# EAGLE design DCDC-12V5V1A (EAGLE 9.6.2)
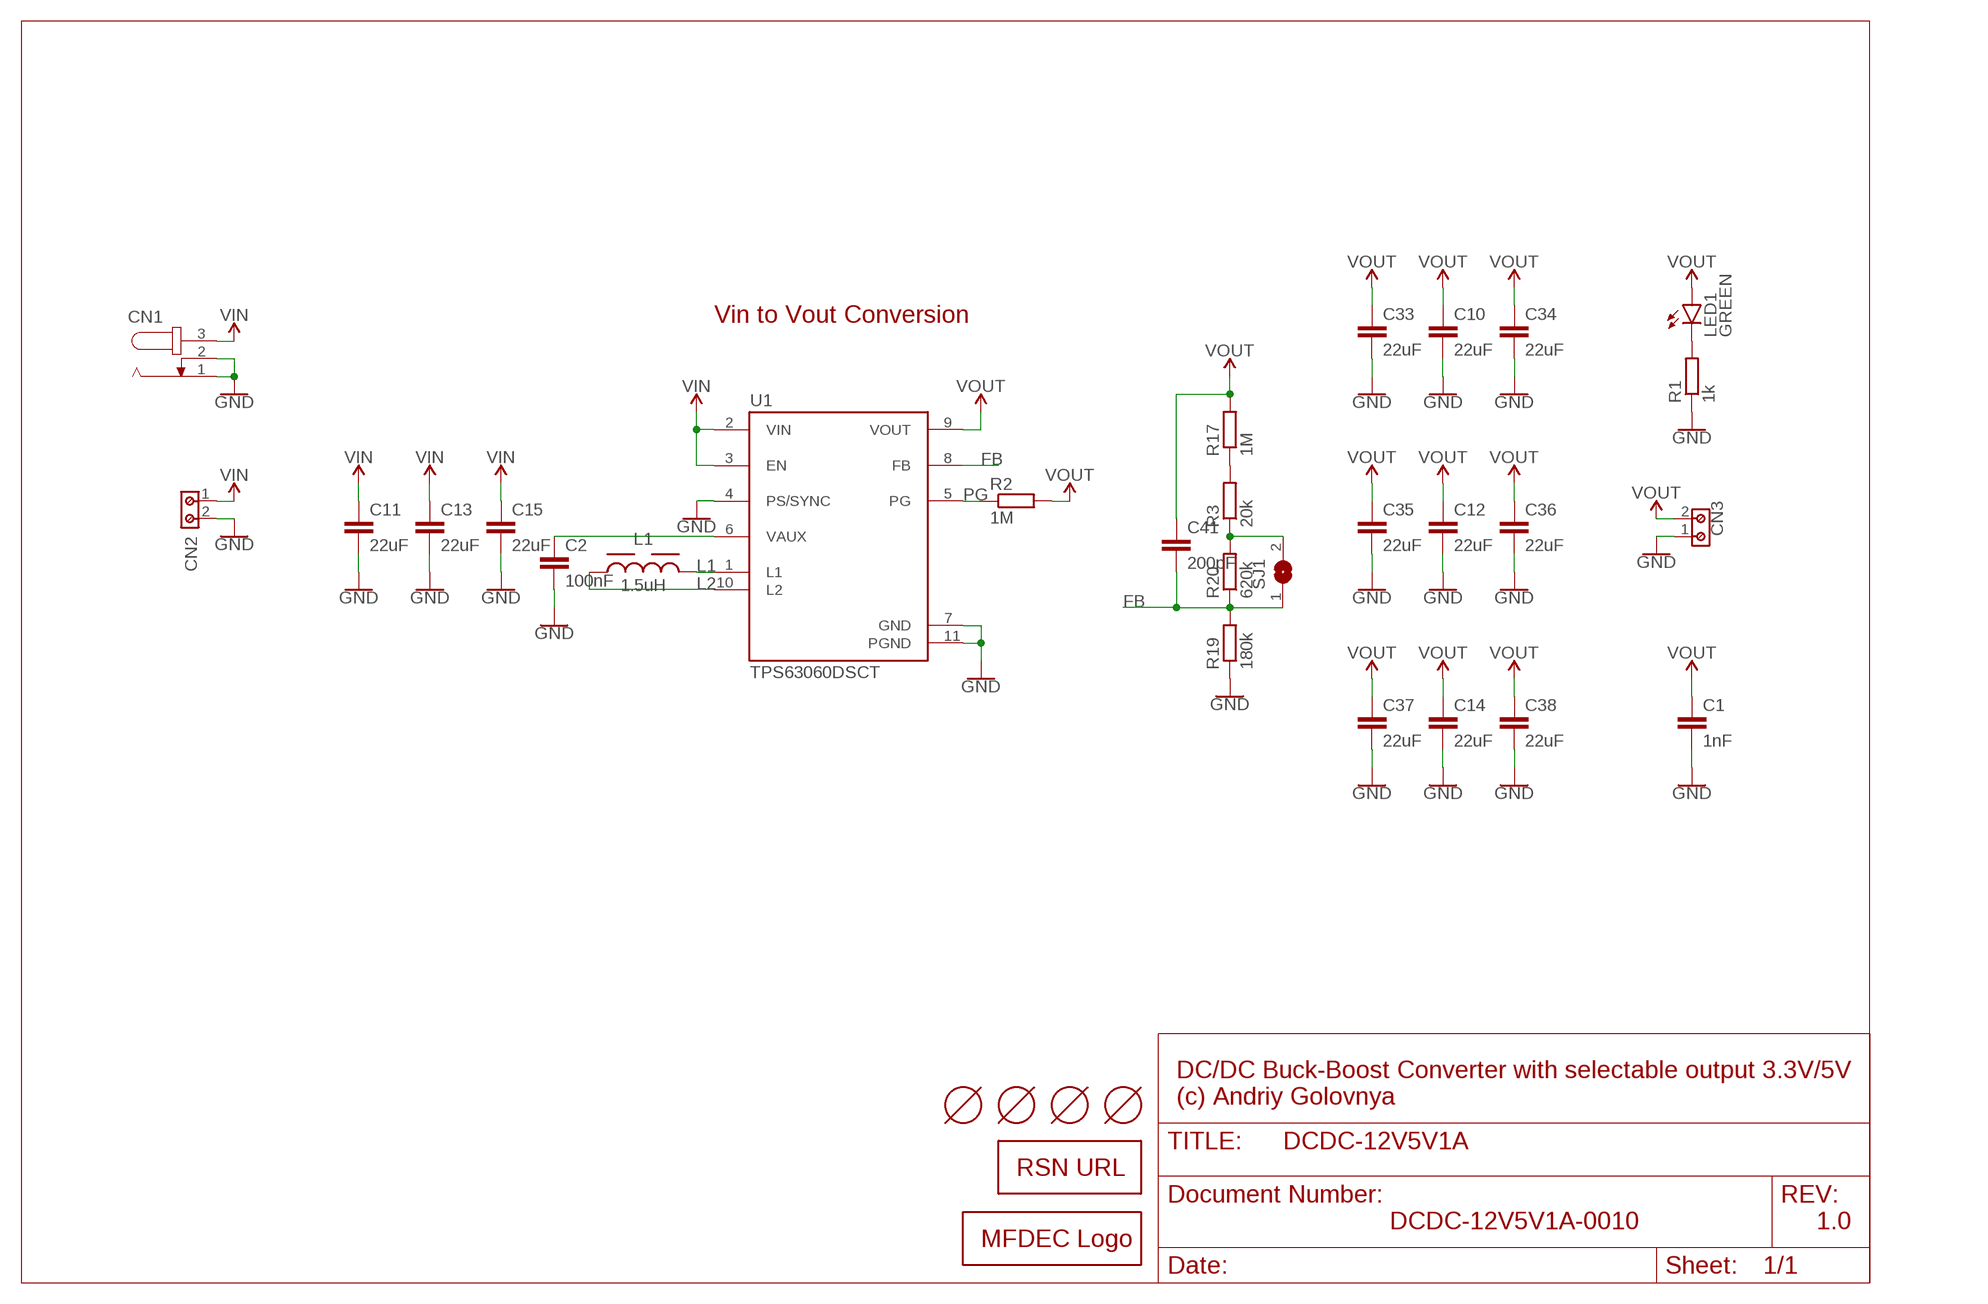
[diagram p0: schematic, sheet 1]

## Parts
C1  1nF  C-EUC0603K  [C0603K]
C2  100nF  C-EUC0603K  [C0603K]
C10  22uF  C-EUC0805K  [C0805K]
C11  22uF  C-EUC0805K  [C0805K]
C12  22uF  C-EUC0805K  [C0805K]
C13  22uF  C-EUC0805K  [C0805K]
C14  22uF  C-EUC0805K  [C0805K]
C15  22uF  C-EUC0805K  [C0805K]
C33  22uF  C-EUC0805K  [C0805K]
C34  22uF  C-EUC0805K  [C0805K]
C35  22uF  C-EUC0805K  [C0805K]
C36  22uF  C-EUC0805K  [C0805K]
C37  22uF  C-EUC0805K  [C0805K]
C38  22uF  C-EUC0805K  [C0805K]
C41  200pF  C-EUC0603K  [C0603K]
CN1  JACK-PLUG1  [SPC4078]
CN2  691213510002  [691213510002]
CN3  691213510002  [691213510002]
HOLE1  TOOLINGHOLE  [TOOLING-HOLE]
HOLE2  TOOLINGHOLE  [TOOLING-HOLE]
HOLE3  TOOLINGHOLE  [TOOLING-HOLE]
HOLE4  TOOLINGHOLE  [TOOLING-HOLE]
L1  1.5uH  WE-LQS_4018_74404042010  [WE-LQS_4018]
LED1  GREEN  LEDSML0603  [SML0603]
LOGO1  RSNURL_QR_8MM  [RSNURL_QR_8MM]
LOGO2  MFDECLOGO_L_10MM  [MFDEC_L_10MM]
R1  1k  R-EU_R0603  [R0603]
R2  1M  R-EU_R0603  [R0603]
R3  20k  R-EU_R0603  [R0603]
R17  1M  R-EU_R0603  [R0603]
R19  180k  R-EU_R0603  [R0603]
R20  620k  R-EU_R0603  [R0603]
SJ1  SJ  [SJ]
U1  TPS63060DSCT  [CONV_TPS63060DSCT]

## Nets
FB: C41.2 R19.2 R20.1 SJ1.1 U1.8(FB)
GND: C1.2 C2.2 C10.2 C11.2 C12.2 C13.2 C14.2 C15.2 C33.2 C34.2 C35.2 C36.2 C37.2 C38.2 CN1.1 CN1.2 CN2.2 CN3.1 R1.1 R19.1 U1.4(PS/SYNC) U1.7(GND) U1.11(PGND)
L1: L1.2 U1.1(L1)
L2: L1.1 U1.10(L2)
N$1: LED1.C R1.2
N$2: R3.2 R17.1
N$3: R3.1 R20.2 SJ1.2
PG: R2.1 U1.5(PG)
VIN: C11.1 C13.1 C15.1 CN1.3 CN2.1 U1.2(VIN) U1.3(EN)
VINA: C2.1 U1.6(VAUX)
VOUT: C1.1 C10.1 C12.1 C14.1 C33.1 C34.1 C35.1 C36.1 C37.1 C38.1 C41.1 CN3.2 LED1.A R2.2 R17.2 U1.9(VOUT)

## Notes on the sheet
- Vin to Vout Conversion
- DC/DC Buck-Boost Converter with selectable output 3.3V/5V
  (c) Andriy Golovnya
- DCDC-12V5V1A-0010 | 1.0

## Library data of the parts
C1 C2 C10-C15 C33-C38 C41 = rcl:C-EU: CAPACITOR, European symbol; SPICEPREFIX: C
CN1 = con-jack:JACK-PLUG: DC POWER JACK Power Jack, DC, Right Angle, Through Hole, Rated 5A at 16VDC, PC Terminals Distributor: Farnell (www.Farnell.de) Drawing: 84N1161.pdf / 84N1162.pdf Manufacturer: SPC Technology (www.spctechnology.com) Type: SPC4077 / SPC 4078; OC_FARNELL: unknown; OC_NEWARK: unknown
CN2 CN3 = Wurth_Connectors_WR-TBL Rising Cage Clamp:691213510002: WR-TBL Serie 2135 - 5.08 mm Horizontal Entry Modular w. Rising Cage Clamp KIND PROPERTIES Pitch 5.08 mm MATERIAL PROPERTIES Insulator Material PA66 Insulator Flammability Rating UL94 V-0 Contact Material Copper Alloy Contact Plating Tin over Nickel Contact Type Stamped Terminal Screw Material Steel Terminal Screw Plating Zinc Wire Guard Material Copper Alloy GENERAL INFORMATION Operating Temperature -30 up to +120 °C Compliance ROHS & Reach ELECTRICAL PROPERTIES IR UL 14 A IR VDE 14 A Working Voltage [UL] 300 V (AC) Working Voltage [VDE] 250 V (AC) Withstanding Voltage [UL] 1600 V (AC) Withstanding Voltage [VDE] 2000 V (AC) Contact Resistance 20 mΩ MECHANICAL PROPERTIES Wire Strip Length 6 Screw M3 CERTIFICATION UL Approval E150931 VDE Approval 40021366 PACKAGING PROPERTIES Packaging Box <https://www.we-online.com/catalog/media/o32805v209%20Family_WR-TBL2_Series2135.jpg> Details see: https://www.we-online.com/catalog/en/TBL_5_08_2135_HORIZONTAL_ENTRY_MODULAR_69121351000x/ Updated by Ella Wu 2019-11-26 2019(C) Wurth Elektronik; IR-UL: 14A; IR-VDE: 14A; PART-NUMBER: 691213510002; PINS: 2; PITCH: 5.08mm; TYPE: Horizontal; WIRE: 14 to 30 (AWG) 2.08 to 0.0509 (mm²); WORKING-VOLTAGE-UL: 300V (AC); WORKING-VOLTAGE-VDE: 250V (AC)
HOLE1-HOLE4 = _my_fiducia:TOOLINGHOLE: JLCPCB Tooling Hole
L1 = Wurth_Power Magnetics_WE-LQS:WE-LQS_4018: WE-LQS SMD Power Inductor Semi Shielded Characteristics Compact design Power Inductor 1.7 times more current than compared to an unshielded version Robust construction Low RDC Magnetically shielded by use of a magnetic resin Operating temperature: -40°C to +125°C Applications Integrated DC/DC Converters Switching controllers which require high efficiency Portable power (PDA, Smartphones, Digital Cameras, TVs, LCD etc.) Embedded Laptops and PCs Big sizes can be used in shock resisting circuits <https://www.we-online.com/catalog/media/o14807v209%20Family_WE-LQS.jpg> Details see: www.we-online.com/catalog/WE-LQS <www.we-online.com/catalog/WE-LQS/?utm_source=eagle_model&utm_medium=description_link&utm_campaign=eisos_eagle> Updated by Ella Wu 2022-07-21 2022 (C) Wurth Elektronik; DATASHEET-URL: https://www.we-online.com/redexpert/spec/74404042010?ae; FRES: 120MHz; IR: 3.2A; ISAT: 4.8A; PART-NUMBER: 74404042010; RDC: 27mOhm; VALUE: 1uH
LED1 = led:LED: LED OSRAM: - CHIPLED LG R971, LG N971, LY N971, LG Q971, LY Q971, LO R971, LY R971 LH N974, LH R974 LS Q976, LO Q976, LY Q976 LO Q996 - Hyper CHIPLED LW Q18S LB Q993, LB Q99A, LB R99A - SideLED LS A670, LO A670, LY A670, LG A670, LP A670 LB A673, LV A673, LT A673, LW A673 LH A674 LY A675 LS A676, LA A676, LO A676, LY A676, LW A676 LS A679, LY A679, LG A679 - Hyper Micro SIDELED® LS Y876, LA Y876, LO Y876, LY Y876 LT Y87S - SmartLED LW L88C, LW L88S LB L89C, LB L89S, LG L890 LS L89K, LO L89K, LY L89K LS L896, LA L896, LO L896, LY L896 - TOPLED LS T670, LO T670, LY T670, LG T670, LP T670 LSG T670, LSP T670, LSY T670, LOP T670, LYG T670 LG T671, LOG T671, LSG T671 LB T673, LV T673, LT T673, LW T673 LH T674 LS T676, LA T676, LO T676, LY T676, LB T676, LH T676, LSB T676, LW T676 LB T67C, LV T67C, LT T67C, LS T67K, LO T67K, LY T67K, LW E67C LS E67B, LA E67B, LO E67B, LY E67B, LB E67C, LV E67C, LT E67C LW T67C LS T679, LY T679, LG T679 LS T770, LO T770, LY T770, LG T770, LP T770 LB T773, LV T773, LT T773, LW T773 LH T774 LS E675, LA E675, LY E675, LS T675 LS T776, LA T776, LO T776, LY T776, LB T776 LHGB T686 LT T68C, LB T68C - Hyper Mini TOPLED® LB M676 - Mini TOPLED Santana® LG M470 LS M47K, LO M47K, LY M47K Source: http://www.osram.convergy.de LUXEON: - LUMILED® LXK2-PW12-R00, LXK2-PW12-S00, LXK2-PW14-U00, LXK2-PW14-V00 LXK2-PM12-R00, LXK2-PM12-S00, LXK2-PM14-U00 LXK2-PE12-Q00, LXK2-PE12-R00, LXK2-PE12-S00, LXK2-PE14-T00, LXK2-PE14-U00 LXK2-PB12-K00, LXK2-PB12-L00, LXK2-PB12-M00, LXK2-PB14-N00, LXK2-PB14-P00, LXK2-PB14-Q00 LXK2-PR12-L00, LXK2-PR12-M00, LXK2-PR14-Q00, LXK2-PR14-R00 LXK2-PD12-Q00, LXK2-PD12-R00, LXK2-PD12-S00 LXK2-PH12-R00, LXK2-PH12-S00 LXK2-PL12-P00, LXK2-PL12-Q00, LXK2-PL12-R00 Source: www.luxeon.com KINGBRIGHT: KA-3528ASYC Source: www.kingbright.com
LOGO1 = _my_logos:RSNURL: RedScorp.Net URL
LOGO2 = _my_logos:MFDECLOGO: Midnight Fog - Digital Eye Candy LOGO
R1-R3 R17 R19 R20 = rcl:R-EU_: RESISTOR, European symbol; SPICEPREFIX: R
SJ1 = _my_jumpers:SJ: SMD solder JUMPER SJ - simple jumper SJFL - fancy left jumper SJFR - fancy right jumper SJW - wide jumper
U1 = TPS63060DSCT:TPS63060DSCT: Check availability <https://pricing.snapeda.com/parts/TPS63060DSCT/Texas%20Instruments/view-part?ref=eda>; AVAILABILITY: In Stock; DESCRIPTION: 2.5V to 12V input voltage, 93% Efficient, 2.25A Switch Current Limit, Buck-Boost Converter; MF: Texas Instruments; MP: TPS63060DSCT; PACKAGE: WSON-10 Texas Instruments; PRICE: None; PURCHASE-URL: https://pricing.snapeda.com/search?q=TPS63060DSCT&ref=eda

## Net classes
0 default: width 0.254 mm

## Board
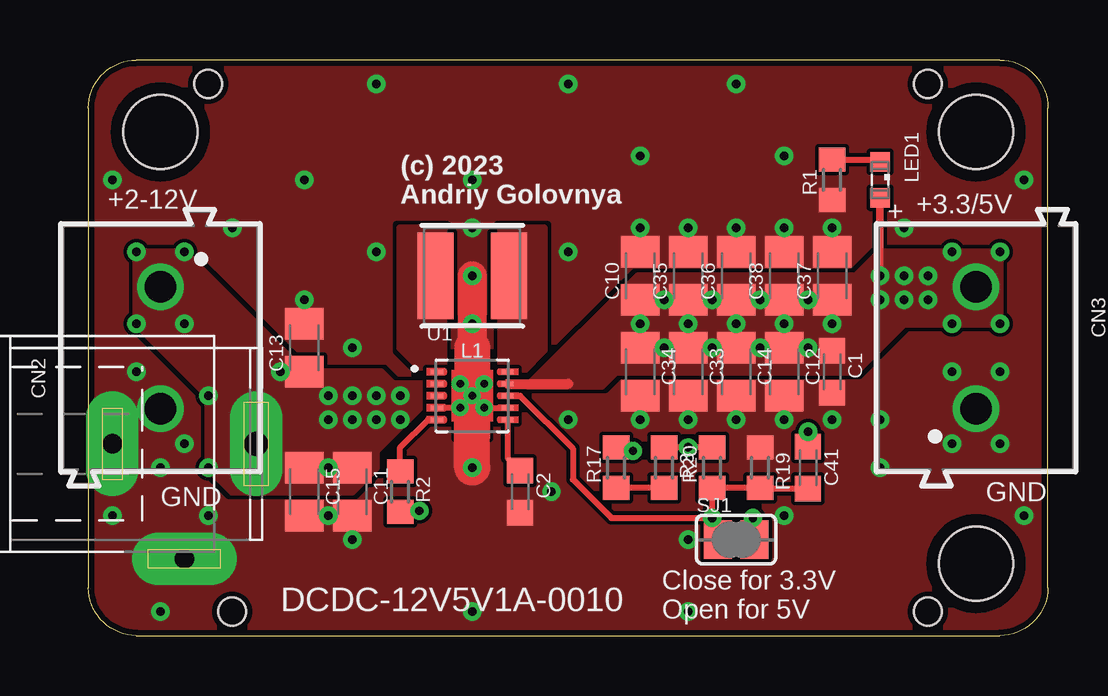
[diagram p1: board, top side]
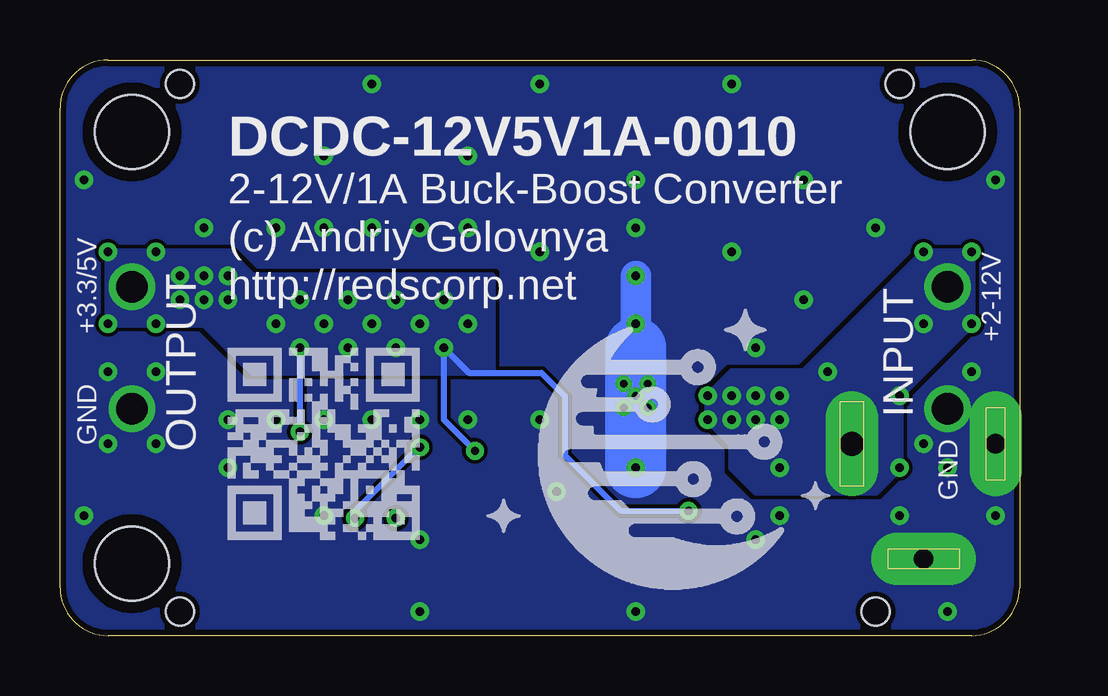
[diagram p2: board, bottom side, seen from below]

Size 40 x 24 mm. Coordinates in mm from the lower left corner, seen from the top.
Outline: 2,0 38,0 arc90 40,2 40,22 arc90 38,24 2,24 arc90 0,22 0,2 arc90 2,0
Copper layers (1*16): Top 0.035mm / dielectric 1.5mm / Bottom 0.035mm
Design rules "default *": minimum track width 6mil, minimum drill 0.35mm, track to track 6mil, track to pad 6mil, pad to pad 6mil, via to via 6mil, smd to smd 6mil, copper to edge 10mil, drill to drill 6mil, minimum pad ring 8mil, minimum via ring 8mil, stop-mask expansion 4mil, vias tented up to drill 20mil, thermal gap 10mil
Holes 3.1 mm at 3,21 37,21 37,3

### Footprints (pad centres in the part's own frame; a part is rotated, then mirrored left to right if it is on the bottom)
C0603K = smd 1.05 x 1.08: 1 -0.875,0; 2 0.875,0
C0805K = smd 1.3 x 1.6: 1 -1,0; 2 1,0
SPC4078 = drill 0.8 pad 2.184 long: 1 -3,0; 2 0,-4.8 | drill 1 pad 2.184 long: 3 3,0
691213510002 = drill 1.3: 1 -2.54,0; 2 2.54,0
TOOLING-HOLE = hole 1.153: 0,0
WE-LQS_4018 = smd 1.5 x 3.6: 1 -1.525,0; 2 1.525,0
SML0603 = smd 0.8 x 0.8: A 0.75,0; C -0.75,0
R0603 = smd 1 x 1.1: 1 -0.85,0; 2 0.85,0
SJ = smd 1.168 x 1.6: 1 -0.762,0; 2 0.762,0
CONV_TPS63060DSCT = smd 0.5 x 0.2: 1 -1.475,1; 2 -1.475,0.5; 3 -1.475,0; 4 -1.475,-0.5; 5 -1.475,-1; 6 1.475,-1; 7 1.475,-0.5; 8 1.475,0; 9 1.475,0.5; 10 1.475,1 | smd 0.5 x 0.5: 11 0,0 | drill 0.3 pad 0.4: 12 -0.5,0.5; 13 0.5,0.5; 14 -0.5,-0.5; 15 0,0; 16 0.5,-0.5

### Placement (x,y rotation side)
C1  31,11 270 top
C2  18,6 270 top
C10  23,15 90 top
C11  11,6 270 top
C12  29,11 270 top
C13  9,12 90 top
C14  27,11 270 top
C15  9,6 270 top
C33  25,11 270 top
C34  23,11 270 top
C35  25,15 90 top
C36  27,15 90 top
C37  31,15 90 top
C38  29,15 90 top
C41  30,7 270 top
CN1  4,8 0 top
CN2  3,12 270 top
CN3  37,12 90 top
HOLE1  35,23 0 top
HOLE2  5,23 0 top
HOLE3  35,1 0 top
HOLE4  6,1 0 top
L1  16,15 180 top
LED1  33,19 270 top
LOGO1  33,4 0 bottom
LOGO2  23,1 0 bottom
R1  31,19 90 top
R2  13,6 270 top
R3  24,7 270 top
R17  22,7 90 top
R19  28,7 270 top
R20  26,7 90 top
SJ1  27,4 0 top
U1  16,10 0 top

### Tracks (layer width: path | path; a pad name or v marks a point on that pad's centre or on a via)
FB  (via drill 0.35)
  Top 0.254: C41.2 28.02,6.12 R19.2 R20.1 v26,4.9 | v26,4.9 26,4.24 SJ1.1 | U1.8 18,10 20.2,7.8 20.2,6.5 21.8,4.9 v26,4.9
GND  (via drill 0.35)
  Top 0.254: U1.7 16.5,9.5 U1.11 15.51,9.51 15.53,9.5 U1.4
  Top 1.2: v16,15 16,12
  Top 1.27: 16,7.43 v16,7
  Top 1.5: v16,7 U1.11 16,12
  Bottom 1.27: v16,15 16,11.17
  Bottom 2.54: v16,7 16,12
  other vias: 33,9 33,7 39,19 39,5 3,7 5,5 1,5 1,19 38,11 36,11 38,8 36,8 4,8 2,11 3,1 11,4 25,1 16,1 16,17 20,16 12,16 16,19 23,17 25,17 27,17 29,17 31,17 29,9 27,9 25,9 23,9 31,9 11,12 20,9 12,23 20,23 27,23 10,5 9,14 9,19 6,17 23,20 29,20 34,17 19.3,6 25,4 29,5
  pour Top (rank 3, no thermals): 40,0 -5,0 -5,24 40,24
  pour Bottom (rank 3, no thermals): 0,24 0,0 45,0 45,24
  cutout Top: 37,1 arc-180 37,5 arc-180
  cutout Top: 37,19 arc-180 37,23 arc-180
  cutout Top: 3,19 arc-180 3,23 arc-180
  cutout Bottom: 3,19 arc-180 3,23 arc-180
  cutout Bottom: 37,19 arc-180 37,23 arc-180
  cutout Bottom: 37,1 arc-180 37,5 arc-180
GND1  (via drill 0.35)
  other vias: 16,13
L1
  pour Top (no thermals): 14.8,11 14.8,17 13,17 13,12 14,11
L2
  pour Top (no thermals): 17.2,11 17.2,17 19,17 19,11.9 18.1,11
N$1
  Top 0.254: R1.2 32.9,19.85 LED1.C
N$2
  Top 0.254: R3.2 R17.1
N$3  (via drill 0.35)
  Top 0.254: R20.2 v25,7.85 R3.1 | SJ1.2 27.76,4.84 v27.7,4.9
  Bottom 0.254: v27.7,4.9 27.7,5.2 25.05,7.85 v25,7.85
PG
  Top 0.254: R2.1 13,7.85 14.15,9 U1.5
VIN  (via drill 0.35)
  other vias: 4,16 4,13 5,10 12,10 12,9 11,10 11,9 10,10 10,9 10,7 2,13 13,10 5,7 8,11 13,9 2,16
  pour Top (no thermals): 2,16 2,13 5,10 5,7 6,6 11,6 12,7 12,7.7 14.3,10 14.8,10 14.8,10.5 12.7,10.5 12.2,11 9,11 4,16
  pour Bottom (no thermals): 2,16 2,13 5,10 5,7 6,6 11,6 12,7 12,8 13,9 13,10 12,11 9,11 4,16
VINA
  Top 0.254: C2.1 17.48,7.4 U1.6
VOUT  (via drill 0.35)
  Top 0.254: C41.1 v30,8.5 | v13.8,5.2 13.75,5.15 R2.2 | R17.2 22.55,7.85 v22.7,7.7
  Top 0.305: LED1.A v33,15
  Top 0.406: U1.9 20,10.5
  Bottom 0.254: v30,8.5 v30,12 | v22.7,7.7 24,9 v24,12 22.96,10.96 19.93,10.96 18.94,9.97 18.94,7.51 16.63,5.2 v13.8,5.2
  other vias: 35,15 35,14 34,15 34,14 33,14 24,14 26,14 28,14 30,14 28,12 26,12 38,16 38,13 23,13 25,13 27,13 29,13 31,13 36,16 36,13
  pour Top (no thermals): 18.3,10.4 22.9,15 32,15 33,16 38,16 38,13 34,13 32,11 22,11 21.4,10.4
  pour Bottom (no thermals): 22,15 22,11 32,11 34,13 38,13 38,16 33,16 32,15

### Text on the board
tPlace: +2-12V | (c) 2023 / Andriy Golovnya | +3.3/5V | + | GND | GND | DCDC-12V5V1A-0010 | Close for 3.3V / Open for 5V
bPlace: DCDC-12V5V1A-0010 | 2-12V/1A Buck-Boost Converter | +3.3/5V | +2-12V | (c) Andriy Golovnya | OUTPUT | INPUT | http://redscorp.net | GND | GND
tRestrict: (c) 2023 / Andriy Golovnya